# Altium schematic sheet ZHSD-Power.SchDoc
size 420 x 297 mm; DocumentNumber: 1; SheetNumber: 2; SheetTotal: 17; Size: A3
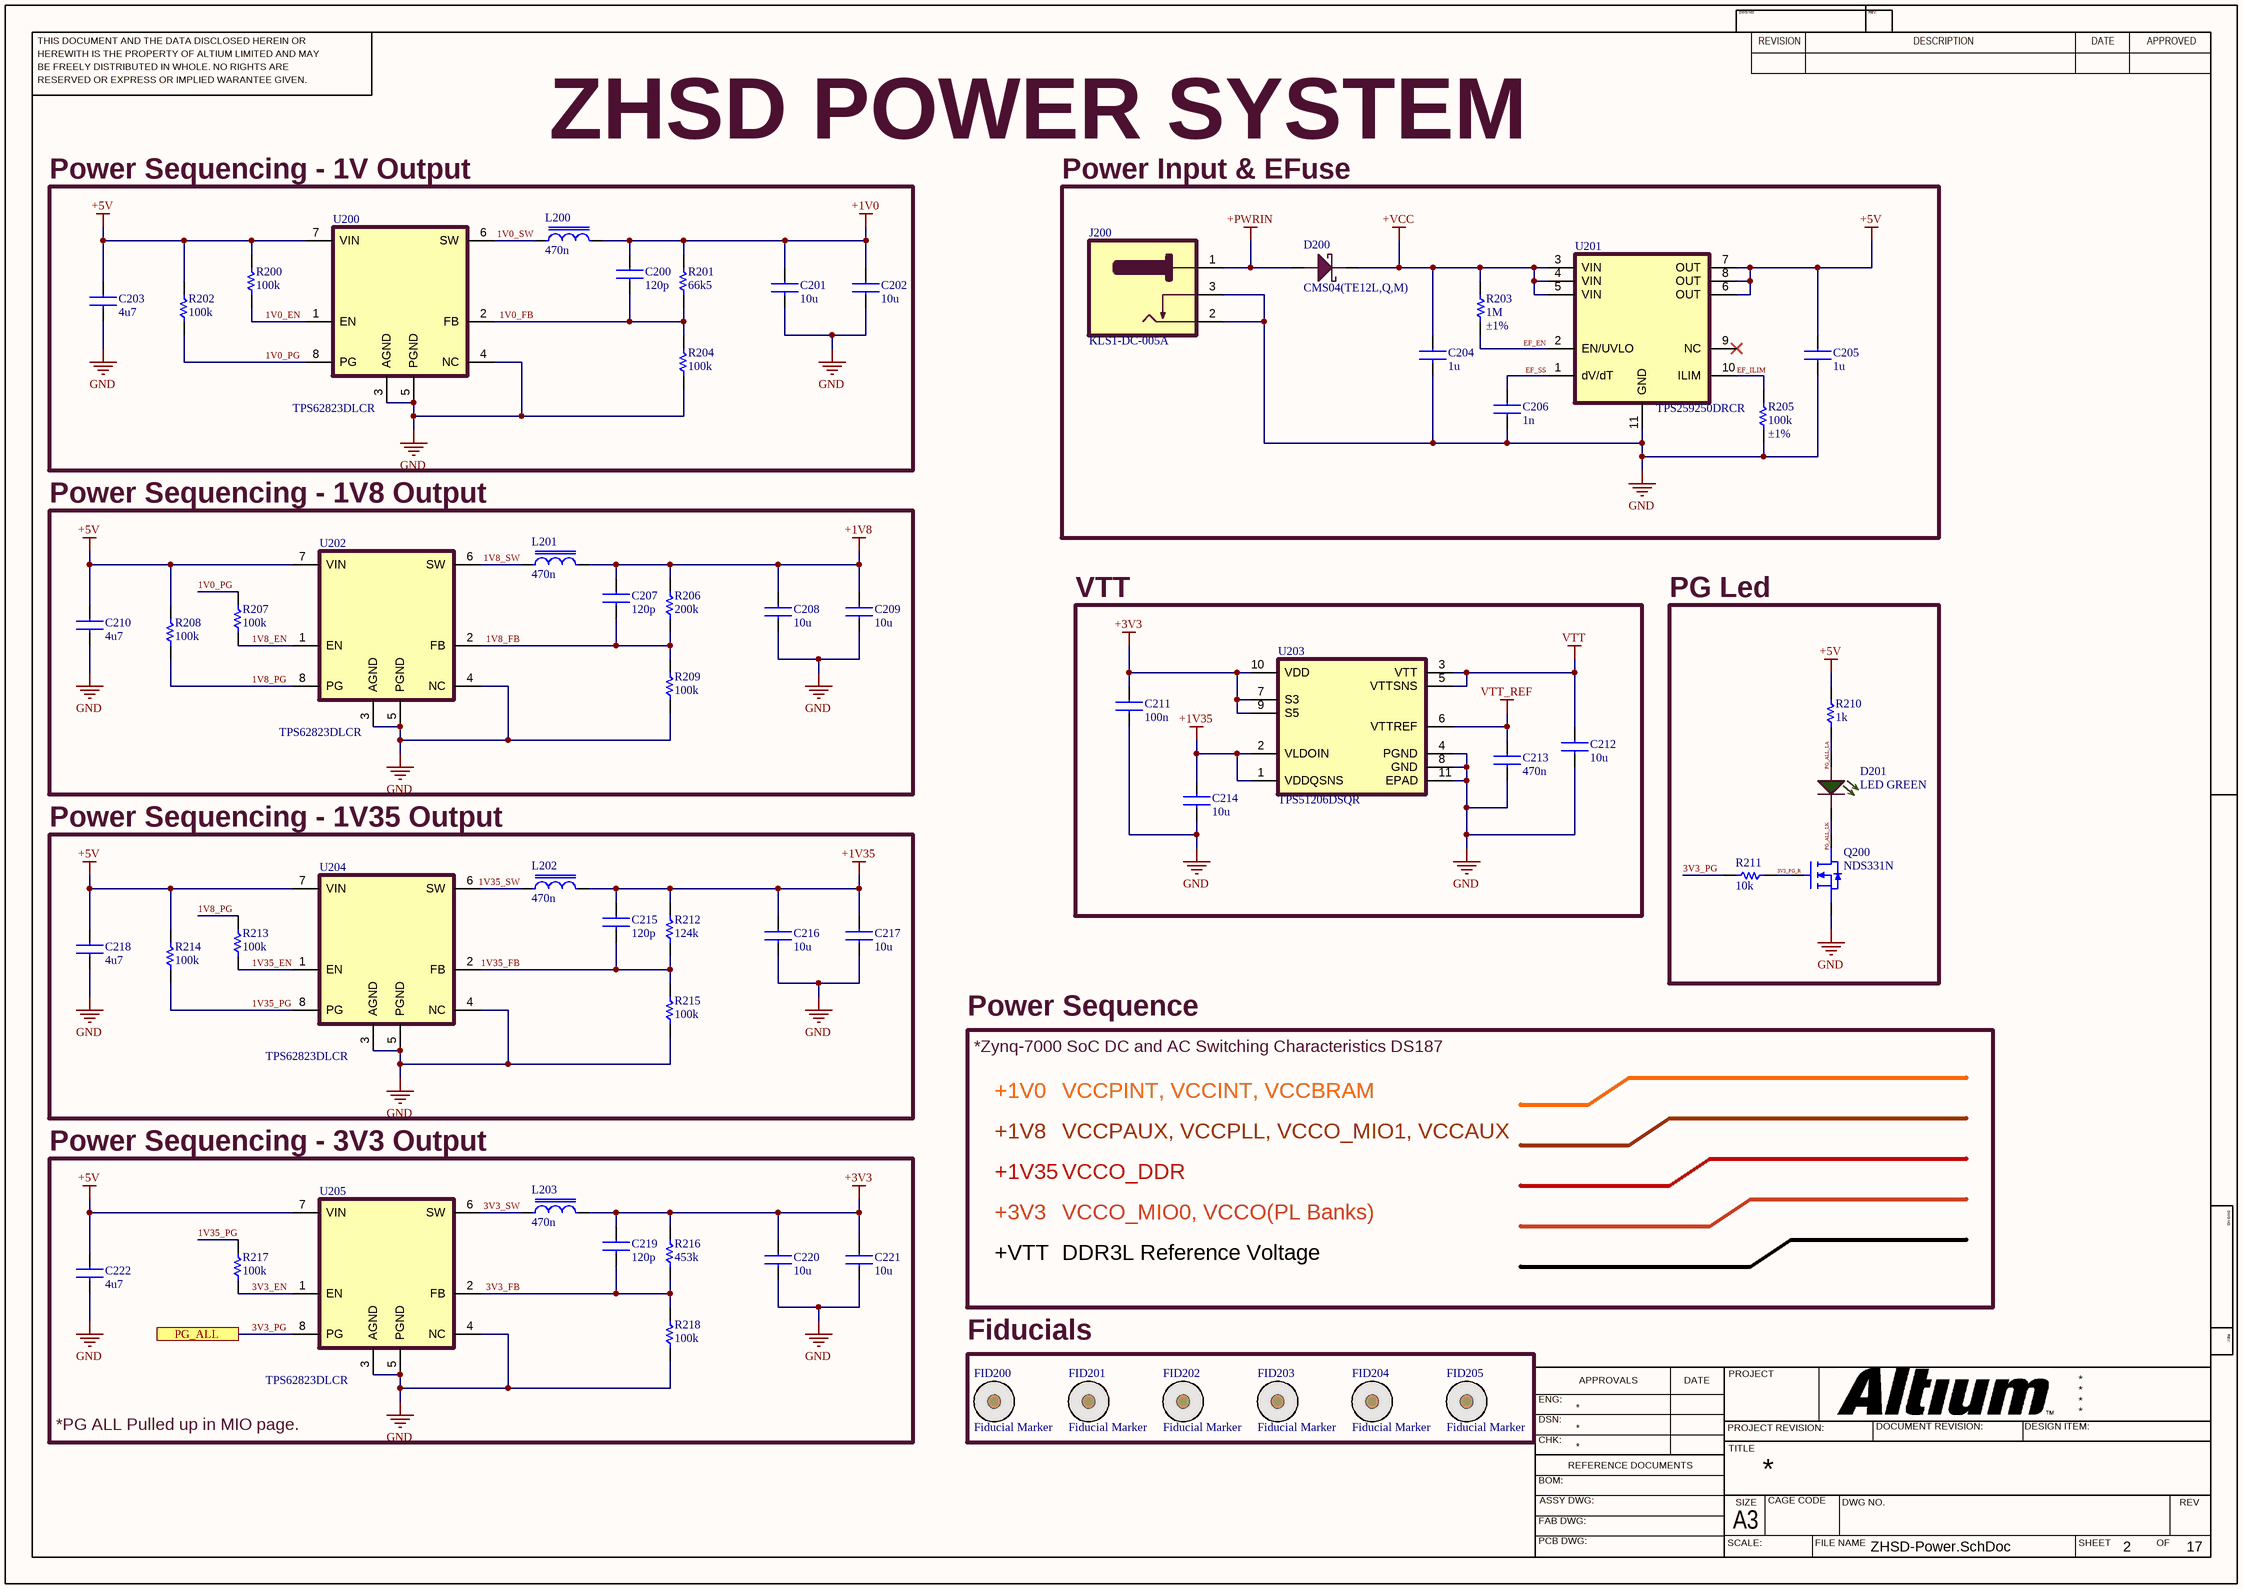
[diagram p0: ZHSD-Power.SchDoc]

## Parts
C200  120p  [0603CAPC1608X09N]
C201  10u  [0603CAPC1608X09N]
C202  10u  [0603CAPC1608X09N]
C203  4u7  [0805CAPC2012X14N]
C204  1u  [0603CAPC1608X09N]
C205  1u  [0603CAPC1608X09N]
C206  1n  [0603CAPC1608X09N]
C207  120p  [0603CAPC1608X09N]
C208  10u  [0603CAPC1608X09N]
C209  10u  [0603CAPC1608X09N]
C210  4u7  [0805CAPC2012X14N]
C211  100n  [0402CAPC1005X06N]
C212  10u  [0603CAPC1608X09N]
C213  470n  [0402CAPC1005X06N]
C214  10u  [0603CAPC1608X09N]
C215  120p  [0603CAPC1608X09N]
C216  10u  [0603CAPC1608X09N]
C217  10u  [0603CAPC1608X09N]
C218  4u7  [0805CAPC2012X14N]
C219  120p  [0603CAPC1608X09N]
C220  10u  [0603CAPC1608X09N]
C221  10u  [0603CAPC1608X09N]
C222  4u7  [0805CAPC2012X14N]
D200  CMS04(TE12L,Q,M)  [SOD-128]
D201  LED GREEN  [0603_LED_1608N]
FID200  Fiducial Marker  [Fiducial]
FID201  Fiducial Marker  [Fiducial]
FID202  Fiducial Marker  [Fiducial]
FID203  Fiducial Marker  [Fiducial]
FID204  Fiducial Marker  [Fiducial]
FID205  Fiducial Marker  [Fiducial]
J200  KLS1-DC-005A  [CONN-KLS1-DC-005A]
L200  470n  [0806INDC2016X10N]
L201  470n  [0806INDC2016X10N]
L202  470n  [0806INDC2016X10N]
L203  470n  [0806INDC2016X10N]
Q200  NDS331N  [SOT95P251X112-3N]
R200  100k  [0603RESC1608X05L]
R201  66k5  [0603RESC1608X05N]
R202  100k  [0603RESC1608X05L]
R203  1M  Tolerance: ±1%  [0603RESC1608X05N]
R204  100k  [0603RESC1608X05L]
R205  100k  Tolerance: ±1%  [0603RESC1608X05L]
R206  200k  [0603RESC1608X05N]
R207  100k  [0603RESC1608X05L]
R208  100k  [0603RESC1608X05L]
R209  100k  [0603RESC1608X05L]
R210  1k  [0402RESC1005X04N]
R211  10k  [0603RESC1608X05N]
R212  124k  [0603RESC1608X05N]
R213  100k  [0603RESC1608X05L]
R214  100k  [0603RESC1608X05L]
R215  100k  [0603RESC1608X05L]
R216  453k  [0603RESC1608X05N]
R217  100k  [0603RESC1608X05L]
R218  100k  [0603RESC1608X05L]
U200  TPS62823DLCR  [VSON50P150X100-8N]
U201  TPS259250DRCR  [VSON50P300X100_HS-11N]
U202  TPS62823DLCR  [VSON50P150X100-8N]
U203  TPS51206DSQR  [WSON2X2-10/SON40P200X80_HS-11N]
U204  TPS62823DLCR  [VSON50P150X100-8N]
U205  TPS62823DLCR  [VSON50P150X100-8N]

## Blocks framed on the sheet
Power Sequencing - 1V Output: C200-C203 L200 R200-R202 R204 U200
Power Input & EFuse: C204-C206 D200 J200 R203 R205 U201
Power Sequencing - 1V8 Output: C207-C210 L201 R206-R209 U202
VTT: C211-C214 U203
PG Led: D201 Q200 R210 R211
Power Sequencing - 1V35 Output: C215-C218 L202 R212-R215 U204
Power Sequencing - 3V3 Output: C219-C222 L203 R216-R218 U205
Fiducials: FID200-FID205

## Ports
PG_ALL (see ZHSD-Block[116.34,200.78], ZHSD-ZYNQ-MIO[286.94,219.28])

## Nets
+1V0: C200.2 C201.2 C202.2 L200.2 R201.2
+1V8: C207.2 C208.2 C209.2 L201.2 R206.2
+1V35: C214.2 C215.2 C216.2 C217.2 L202.2 R212.2 U203.1(VDDQSNS) U203.2(VLDOIN)
+3V3: C211.2 C219.2 C220.2 C221.2 L203.2 R216.2 U203.7(S3) U203.9(S5) U203.10(VDD)
+5V: C203.2 C205.2 C210.2 C218.2 C222.2 R200.2 R202.2 R208.2 R210.2 R214.2 U200.7(VIN) U201.6(OUT) U201.7(OUT) U201.8(OUT) U202.7(VIN) U204.7(VIN) U205.7(VIN)
+PWRIN: D200.A J200.1(VCC)
+VCC: C204.2 D200.C R203.1 U201.3(VIN) U201.4(VIN) U201.5(VIN)
GND: C201.1 C202.1 C203.1 C204.1 C205.1 C206.1 C208.1 C209.1 C210.1 C211.1 C212.1 C213.1 C214.1 C216.1 C217.1 C218.1 C220.1 C221.1 C222.1 J200.2(GND) J200.3(SH) Q200.2(S) R204.1 R205.1 R209.1 R215.1 R218.1 U200.3(AGND) U200.4(NC) U200.5(PGND) U201.11(GND) U202.3(AGND) U202.4(NC) U202.5(PGND) U203.4(PGND) U203.8(GND) U203.11(EPAD) U204.3(AGND) U204.4(NC) U204.5(PGND) U205.3(AGND) U205.4(NC) U205.5(PGND)
VTT: C212.2 U203.3(VTT) U203.5(VTTSNS)
VTT_REF: C213.2 U203.6(VTTREF)
1V0_EN: R200.1 U200.1(EN)
1V0_FB: C200.1 R201.1 R204.2 U200.2(FB)
1V0_PG: R202.1 R207.2 U200.8(PG)
1V0_SW: L200.1 U200.6(SW)
1V8_EN: R207.1 U202.1(EN)
1V8_FB: C207.1 R206.1 R209.2 U202.2(FB)
1V8_PG: R208.1 R213.2 U202.8(PG)
1V8_SW: L201.1 U202.6(SW)
1V35_EN: R213.1 U204.1(EN)
1V35_FB: C215.1 R212.1 R215.2 U204.2(FB)
1V35_PG: R214.1 R217.2 U204.8(PG)
1V35_SW: L202.1 U204.6(SW)
3V3_EN: R217.1 U205.1(EN)
3V3_FB: C219.1 R216.1 R218.2 U205.2(FB)
3V3_PG: R211.2 U205.8(PG) ; port PG_ALL
3V3_PG_R: Q200.1(G) R211.1
3V3_SW: L203.1 U205.6(SW)
EF_EN: R203.2 U201.2(EN/UVLO)
EF_ILIM: R205.2 U201.10(ILIM)
EF_SS: C206.2 U201.1(dV/dT)
PG_ALL_LA: D201.1(A) R210.1
PG_ALL_LK: D201.2(C) Q200.3(D)

Not connected (* = marked no-connect by the designer): U201 9(NC)*

## Notes on the sheet
- ZHSD POWER SYSTEM
- Power Sequence
- *Zynq-7000 SoC DC and AC Switching Characteristics DS187
- +1V0
- +1V8
- VCCPINT, VCCINT, VCCBRAM
- VCCPAUX, VCCPLL, VCCO_MIO1, VCCAUX
- +1V35
- VCCO_DDR
- +3V3
- +VTT
- VCCO_MIO0, VCCO(PL Banks)
- DDR3L Reference Voltage
- *PG ALL Pulled up in MIO page.
- THIS DOCUMENT AND THE DATA DISCLOSED HEREIN OR
- HEREWITH IS THE PROPERTY OF ALTIUM LIMITED AND MAY
- DWG NO:
- REVISION
- REV:
- DESCRIPTION
- DATE
- APPROVED
- BE FREELY DISTRIBUTED IN WHOLE. NO RIGHTS ARE
- RESERVED OR EXPRESS OR IMPLIED WARANTEE GIVEN.
- ENG:
- APPROVALS
- PROJECT
- DSN:
- CHK:
- REFERENCE DOCUMENTS
- PROJECT REVISION:
- TITLE
- DOCUMENT REVISION:
- DESIGN ITEM:
- BOM:
- FAB DWG:
- PCB DWG:
- ASSY DWG:
- SCALE:
- A3
- SIZE
- CAGE CODE
- FILE NAME
- DWG NO.
- SHEET
- OF
- REV

## Library data of the parts
C200 C207 C215 C219 = GRM1885C1H121JA01D: CAP CER 120PF 50V C0G/NP0 0603 (1608) ±5%; Manufacturer: Murata Electronics; ComponentLink1Description: Datasheet; ComponentLink1URL: https://search.murata.co.jp/Ceramy/image/img/A01X/G101/ENG/GRM1885C1H121JA01-01.pdf; MPN: GRM1885C1H121JA01D; Package: 0603; Tolerance: ±5%; Value: 120 pF; Voltage: 50V
C201 C202 C208 C209 C212 C214 C216 C217 C220 C221 = GRM188Z71A106MA73D: CAP CER 10UF 10V X7R 0603 (1608) ±20%; Manufacturer: Murata Electronics; Value: 10 µF; ComponentLink1Description: Datasheet; ComponentLink1URL: https://search.murata.co.jp/Ceramy/image/img/A01X/G101/ENG/GRM188Z71A106MA73-01A.pdf; MPN: GRM188Z71A106MA73D; Package: 0603; Tolerance: ±20%; Voltage: 10V
C203 C210 C218 C222 = GRM21BR71A475KE51L: CAP CER 4.7UF 10V X7R 0805 (2012) ±10%; Manufacturer: Murata Electronics; Value: 4.7 µF; ComponentLink1Description: Datasheet; ComponentLink1URL: https://search.murata.co.jp/Ceramy/image/img/A01X/G101/ENG/GRM21BR71A475KE51-01.pdf; MPN: GRM21BR71A475KE51L; Package: 0805; Tolerance: ±10%; Voltage: 10V
C204 C205 = GRM188R61E105KA12D: CAP CER 1UF 25V X5R 0603 (1608) ±10%; Manufacturer: Murata Power Solutions Inc.; Value: 1 µF; ComponentLink1Description: Datasheet; ComponentLink1URL: https://search.murata.co.jp/Ceramy/image/img/A01X/G101/ENG/GRM188R61E105KA12-01.pdf; MPN: GRM188R61E105KA12D; Package: 0603; Tolerance: ±10%; Voltage: 25V
C206 = GCM188R71H102KA37D: CAP CER 1000PF 50V X7R 0603 (1608) ±10%; Manufacturer: Murata Electronics; ComponentLink1Description: Datasheet; ComponentLink1URL: https://search.murata.co.jp/Ceramy/image/img/A01X/G101/ENG/GCM188R71H102KA37-01.pdf; MPN: GCM188R71H102KA37D; Package: 0603; Tolerance: ±10%; Value: 1000 pF; Voltage: 50V
C211 = GRM155R71C104KA88J: CAP CER 0.1UF 16V X7R 0402 (1005) ±10%; Manufacturer: Murata Electronics; Value: 0.1 µF; ComponentLink1Description: Datasheet; ComponentLink1URL: https://search.murata.co.jp/Ceramy/image/img/A01X/G101/ENG/GRM155R71C104KA88-01.pdf; MPN: GRM155R71C104KA88J; Package: 0402; Tolerance: ±10%; Voltage: 16V
C213 = GRM155R60J474KE19D: CAP CER 0.47UF 6.3V X5R 0402(1005) ±10%; Manufacturer: Murata Electronics; Value: 0.47 µF; ComponentLink1Description: Datasheet; ComponentLink1URL: https://search.murata.co.jp/Ceramy/image/img/A01X/G101/ENG/GRM21BR71A475KE51-01.pdf; MPN: GRM155R60J474KE19D; Package: 0402; Tolerance: ±10%; Voltage: 6.3V
D200 = CMS04: Diode 30 V 5A Surface Mount M-FLAT (2.4x3.8); Manufacturer: Toshiba Semiconductor and Storage; ComponentLink1Description: Datasheet; ComponentLink1URL: https://toshiba.semicon-storage.com/info/CMS04_datasheet_en_20180911.pdf?did=3133&prodName=CMS04; MPN: CMS04(TE12L,Q; Package: SOD-123
D201 = LTST-C191TGKT: LED GREEN CLEAR CHIP SMD; Manufacturer: Lite-On Inc.; ComponentLink1Description: Datasheet; ComponentLink1URL: https://optoelectronics.liteon.com/upload/download/DS22-2000-300/LTST-C191TGKT.PDF; MPN: LTST-C191TGKT; Package: 0603
FID200-FID205 = Fiducial_Marker: Fiducial Marker 1mm No Bom
J200 = KLS1-DC-005A: CONNECTOR DC JACK POWER PCB TYPE 2.50MM KLS; Manufacturer: KLS ELECTRONIC; MPN: L-KLS1-DC-005A-2.0; ComponentLink1Description: Datasheet; ComponentLink1URL: https://www.ozdisan.com/api/pdf/product/assets/KLS1-DC-005A.pdf
L200-L203 = DFE201610E-R47M=P2: FIXED IND 470NH 3.6A 32 MOHM SMD 0806 (2016 Metric); Manufacturer: Murata Electronics; DC Resistance (DCR) (Max): 32mOhm; Current - Saturation (Isat): 4.8A; ComponentLink1Description: Datasheet; ComponentLink1URL: https://pim.murata.com/asset/pim4/inductor/J(E)TE243A-0001_PDF_INDUCTOR?lastModifiedDatetime=20250708072022; ComponentLink2Description: Website; ComponentLink2URL: https://pim.murata.com/en-global/pim/details/?partNum=DFE201610E-R47M%23; Current Rating (Max): 3.6 A; Inductance: 470 nH; MPN: DFE201610E-R47M=P2; Package: 0806
Q200 = NDS331N: N-Channel 20 V 1.3A (Ta) 500mW (Ta) Surface Mount SOT-23-3; Manufacturer: onsemi; Drain to Source Voltage (Vdss): 20 V; Rds On (Max) @ Id, Vgs: 160mOhm @ 1.5A, 4.5V; Vgs (Max): ±8V; ComponentLink1Description: Datasheet; ComponentLink1URL: https://www.onsemi.com/pdf/datasheet/nds331n-d.pdf; MPN: NDS331N; Package: SOT-23-3
R200 R202 R204 R205 R207-R209 R213-R215 R217 R218 = CRCW0603100KFKEA: RES SMD 100K OHM 1% 1/8W 0603 (1608); Manufacturer: Vishay Dale; Value: 100 kOhms; Voltage: 75V; ComponentLink1Description: Datasheet; ComponentLink1URL: https://www.vishay.com/docs/20035/dcrcwe3.pdf; MPN: CRCW0603100KFKEA; Package: 0603
  R200 R202 R204 R207-R209 R213-R215 R217 R218: Tolerance: ±1%
R201 = CRCW060366K5FKEA: RES SMD 66.5K OHM 1% 1/8W 0603 (1608); Manufacturer: Vishay Dale; Value: 66.5 kOhms; Voltage: 75V; ComponentLink1Description: Datasheet; ComponentLink1URL: https://www.vishay.com/docs/20035/dcrcwe3.pdf; MPN: CRCW060366K5FKEA; Tolerance: ±1%; Package: 0603
R203 = CRCW06031M00FKEA: RES SMD 1M OHM 1% 1/8W 0603 (1608); Manufacturer: Vishay Dale; Value: 1 MOhms; Voltage: 75V; ComponentLink1Description: Datasheet; ComponentLink1URL: https://www.vishay.com/docs/20035/dcrcwe3.pdf; MPN: CRCW06031M00FKEA; Package: 0603
R206 = CRCW0603200KFKEBC: RES 200K OHM 1% 1/10W 0603 (1608); Manufacturer: Vishay Dale; Value: 200 kOhms; Voltage: 75V; ComponentLink1Description: Datasheet; ComponentLink1URL: https://www.vishay.com/docs/28773/crcwce3.pdf; MPN: CRCW0603200KFKEBC; Tolerance: ±1%; Package: 0603
R210 = RC0402JR-071KL: RES 1K OHM 5% 1/16W 0402 (1005); Manufacturer: YAGEO; Value: 1 kOhms; Voltage: 50V; ComponentLink1Description: Datasheet; ComponentLink1URL: https://yageogroup.com/content/datasheet/asset/file/PYU-RT_1-TO-0-01_ROHS_L; MPN: RC0402JR-071KL; Tolerance: ±5%; Package: 0402
R211 = RC0603FR-0710KL: RES 10K OHM 1% 1/10W 0603(1608); Manufacturer: YAGEO; Value: 10 kOhms; Voltage: 75V; ComponentLink1Description: Datasheet; ComponentLink1URL: https://yageogroup.com/content/datasheet/asset/file/PYU-RC_GROUP_51_ROHS_L; MPN: RC0603FR-0710KL; Tolerance: ±1%; Package: 0603
R212 = CRCW0603124KFKEA: RES SMD 124K OHM 1% 1/8W 0603 (1608); Manufacturer: Vishay Dale; Value: 124 kOhms; Voltage: 75V; ComponentLink1Description: Datasheet; ComponentLink1URL: https://www.vishay.com/docs/20035/dcrcwe3.pdf; MPN: CRCW0603124KFKEA; Tolerance: ±1%; Package: 0603
R216 = CRCW0603453KFKEAC: RES 453K OHM 1% 1/10W 0603(1608); Manufacturer: Vishay Dale; Value: 453 kOhms; Voltage: 75V; ComponentLink1Description: Datasheet; ComponentLink1URL: https://www.vishay.com/docs/28773/crcwce3.pdf; MPN: CRCW0603453KFKEAC; Tolerance: ±1%; Package: 0603
U200 U202 U204 U205 = TPS62823DLCR: 2.4-V to 5.5-V input, 3-A step-down converter with 1% accuracy in 1.5-mm x 2-mm VSON-HR package; Manufacturer: Texas Instruments; ComponentLink1Description: Datasheet; ComponentLink1URL: https://www.ti.com/lit/ds/symlink/tps62823.pdf; ComponentLink2Description: Evaluation Module; ComponentLink2URL: https://www.ti.com/lit/ug/slvuba0/slvuba0.pdf; MPN: TPS62823DLCR
U201 = TPS259250DRCR: Electronic Fuse Regulator 5A 10-VSON (3x3); Manufacturer: Texas Instruments; ComponentLink1Description: Datasheet; ComponentLink1URL: https://www.ti.com/lit/ds/symlink/tps25925.pdf?HQS=dis-dk-null-digikeymode-dsf-pf-null-wwe&ts=1768606527240&ref_url=https%253A%252F%252Fwww.ti.com%252Fgeneral%252Fdocs%252Fsuppproductinfo.tsp%253FdistId%253D10%2526gotoUrl%253Dhttps%253A%252F%252Fwww.ti.com%252Flit%252Fgpn%252Ftps25925; ComponentLink2Description: Evaluation Module; ComponentLink2URL: https://www.ti.com/lit/ug/sluub64/sluub64.pdf?ts=1768615249837; MPN: TPS259250DRCR
U203 = TPS51206: Converter, DDR Voltage Regulator IC 1 Output 10-WSON (2x2); Manufacturer: Texas Instruments; ComponentLink1Description: Datasheet; ComponentLink1URL: https://www.ti.com/lit/ds/symlink/tps51206.pdf?HQS=dis-dk-null-digikeymode-dsf-pf-null-wwe&ts=1769211972272&ref_url=https%253A%252F%252Fwww.ti.com%252Fgeneral%252Fdocs%252Fsuppproductinfo.tsp%253FdistId%253D10%2526gotoUrl%253Dhttps%253A%252F%252Fwww.ti.com%252Flit%252Fgpn%252Ftps51206; MPN: TPS51206DSQR; Package: 10-WSON